# EAGLE design wifischematic (EAGLE 7.5.0)
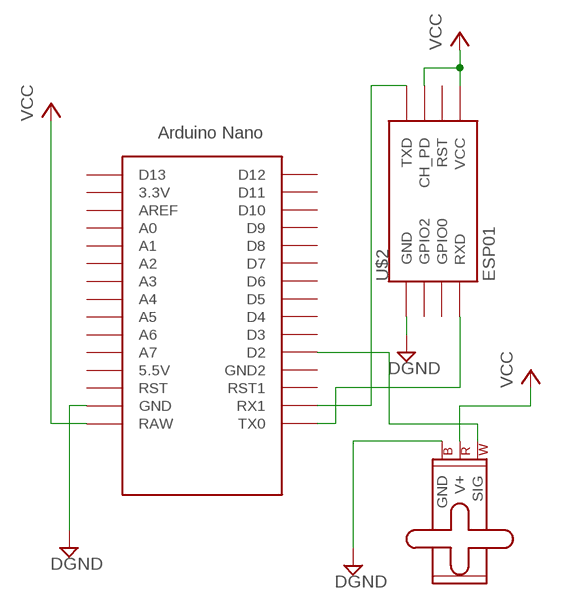
[diagram p0: schematic, sheet 1]

## Parts
M1  SMALL_SERVO  [1X03]
U$1  NANO  [NANO]
U$2  ESP01  [ESP01]

## Nets
DGND: M1.3(GND) U$1.GND U$2.GND
N$2: U$1.TX0 U$2.RX(RXD)
N$3: U$1.RX1 U$2.TX(TXD)
N$4: M1.1(SIG) U$1.D2
VCC: M1.2(V+) U$1.RAW U$2.CH_PD U$2.VCC
Unconnected: U$1.3.3V U$1.5V(5.5V) U$1.A0 U$1.A1 U$1.A2 U$1.A3 U$1.A4 U$1.A5 U$1.A6 U$1.A7 U$1.AREF U$1.D3 U$1.D4 U$1.D5 U$1.D6 U$1.D7 U$1.D8 U$1.D9 U$1.D10 U$1.D11 U$1.D12 U$1.D13 U$1.GND1(GND2) U$1.ICSP1 U$1.ICSP2 U$1.ICSP3 U$1.ICSP4 U$1.ICSP5 U$1.ICSP6 U$1.RST U$1.RST1 U$2.GPIO0 U$2.GPIO2 U$2.RST

## Library data of the parts
M1 = SparkFun-Electromechanical:SMALL_SERVO: Small servo motor This is the small servo used in the SIK. SKU: ROB-09065
U$1 = Arduino-clone:NANO: Arduino Nano
U$2 = esp8266modules:ESP01: ESP8266 Wifi module 01

## Board
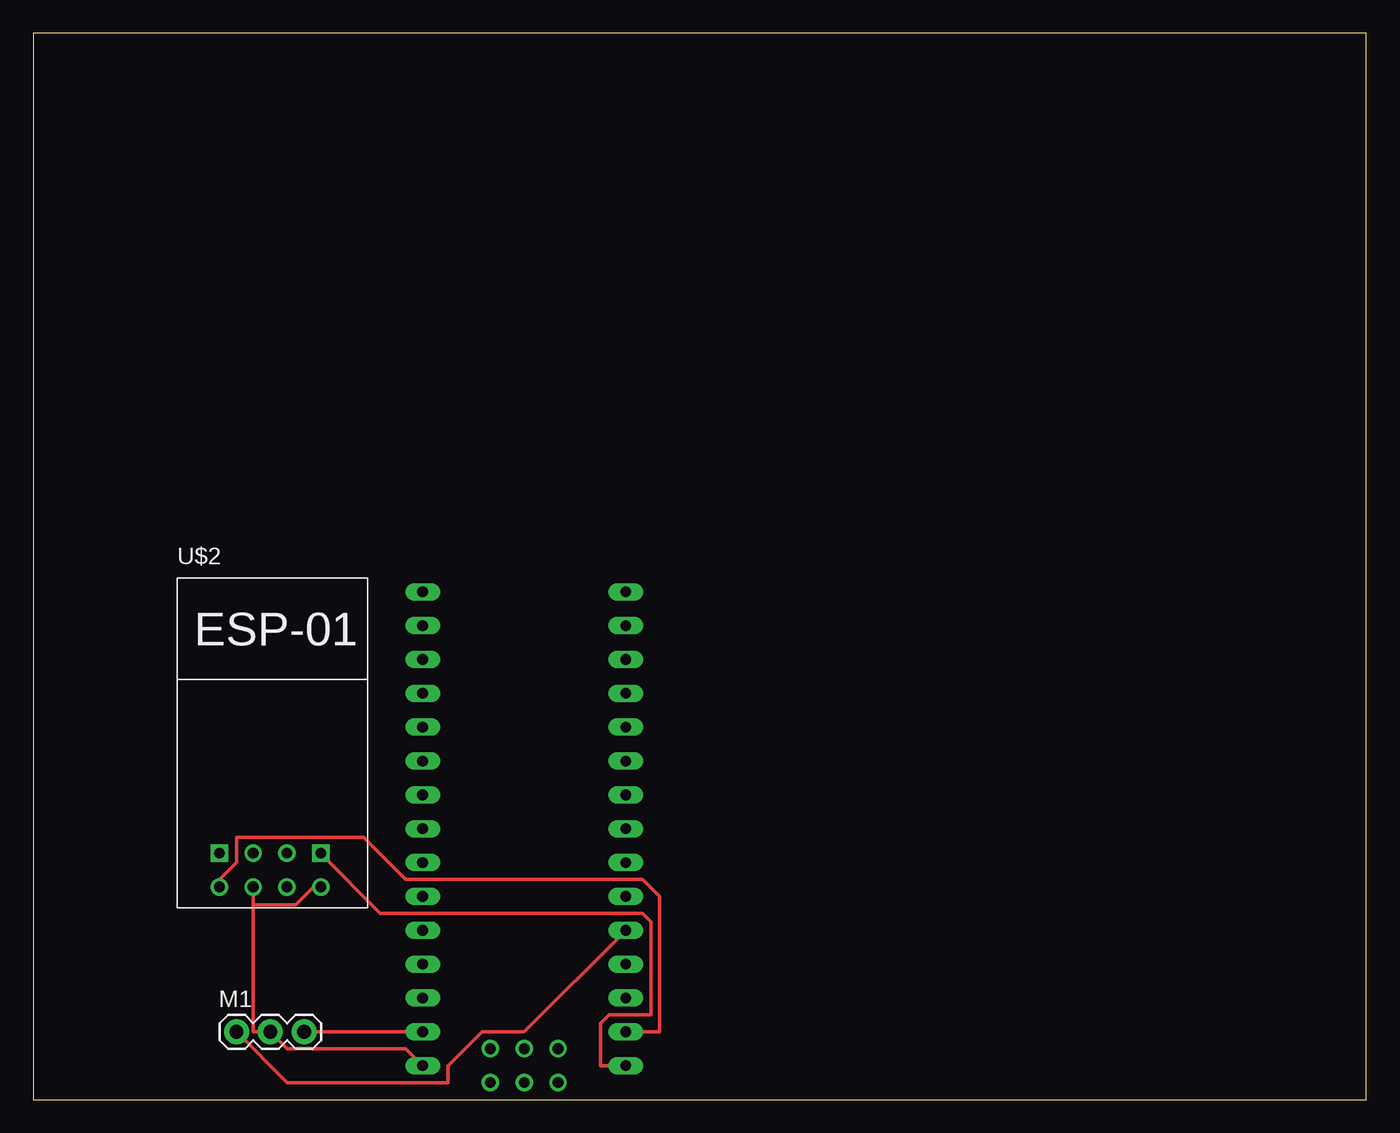
[diagram p1: board, top side]
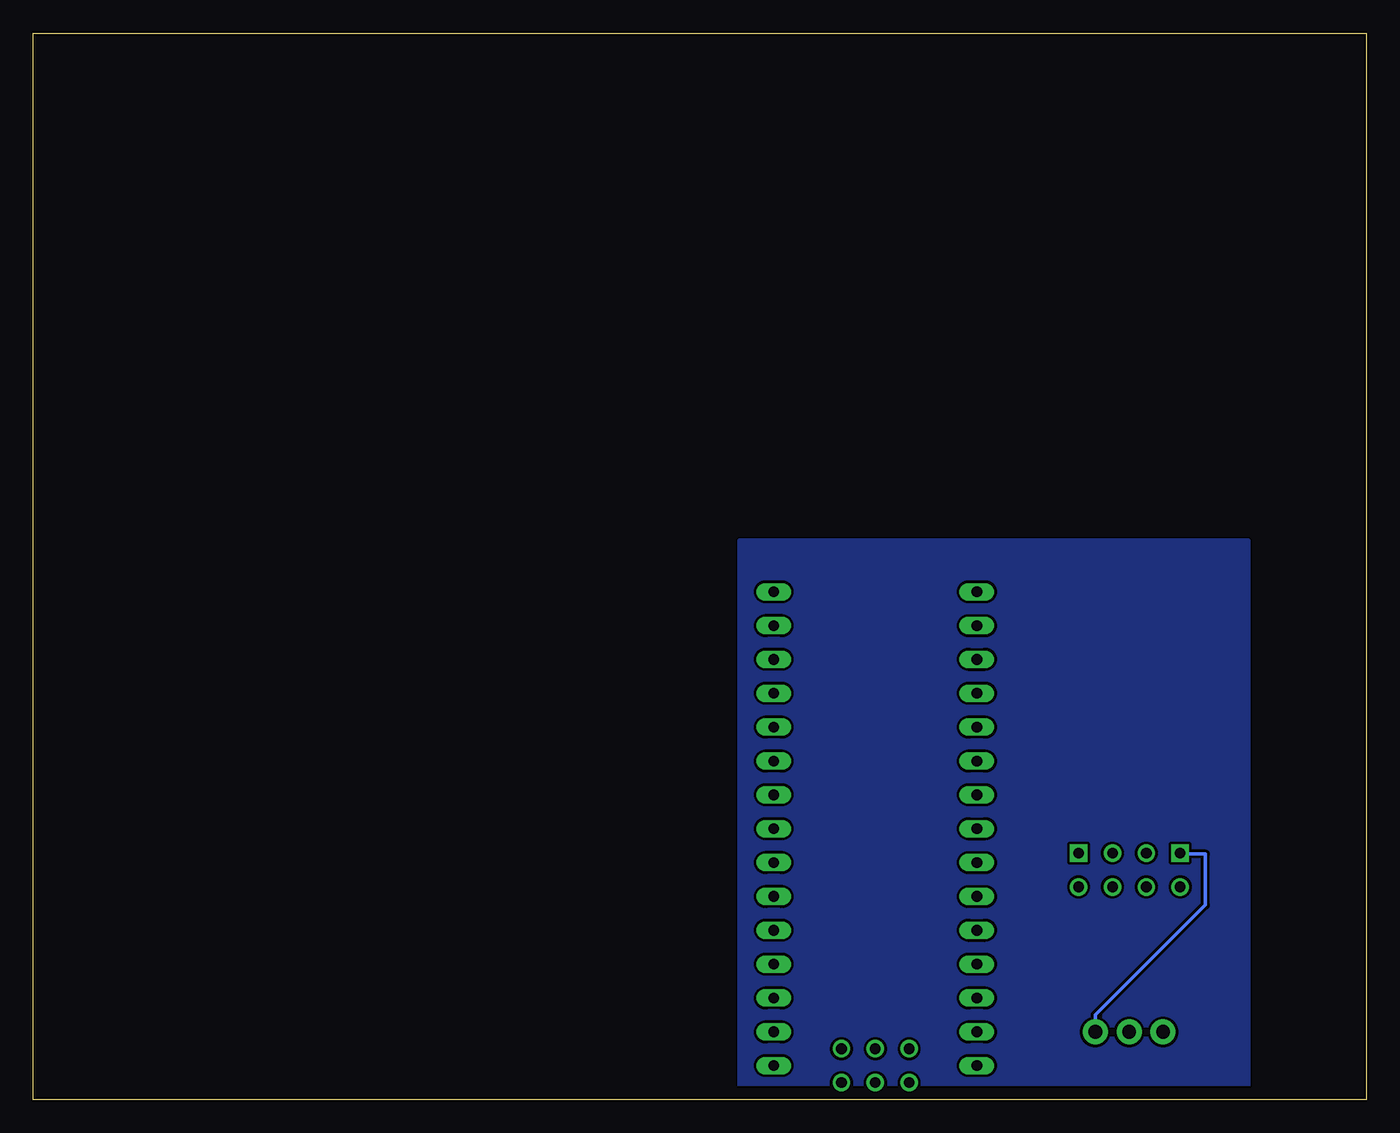
[diagram p2: board, bottom side, seen from below]

Size 100 x 80 mm. Coordinates in mm from the lower left corner, seen from the top.
Outline: 0,0 100,0 100,80 0,80 0,0
Copper layers (1*16): Top 0.035mm / dielectric 1.5mm / Bottom 0.035mm
Design rules "default": minimum track width 10mil, minimum drill 24mil, track to track 8mil, track to pad 8mil, pad to pad 8mil, via to via 8mil, smd to smd 8mil, copper to edge 40mil, drill to drill 8mil, minimum pad ring 10mil, minimum via ring 8mil, stop-mask expansion 4mil, vias tented up to drill 0mil, thermal gap 10mil

### Footprints (pad centres in the part's own frame; a part is rotated, then mirrored left to right if it is on the bottom)
1X03 = drill 1.016 pad 1.88: 1 0,0; 2 2.54,0; 3 5.08,0
NANO = drill 0.8 long: 3.3V -10.16,24.13; 5V -10.16,-1.27; A0 -10.16,19.05; A1 -10.16,16.51; A2 -10.16,13.97; A3 -10.16,11.43; A4 -10.16,8.89; A5 -10.16,6.35; A6 -10.16,3.81; A7 -10.16,1.27; AREF -10.16,21.59; D2 5.08,1.27; D3 5.08,3.81; D4 5.08,6.35; D5 5.08,8.89; D6 5.08,11.43; D7 5.08,13.97; D8 5.08,16.51; D9 5.08,19.05; D10 5.08,21.59; D11 5.08,24.13; D12 5.08,26.67; D13 -10.16,26.67; GND -10.16,-6.35; GND1 5.08,-1.27; RAW -10.16,-8.89; RST -10.16,-3.81; RST1 5.08,-3.81; RX1 5.08,-6.35; TX0 5.08,-8.89 | drill 0.8: ICSP1 -5.08,-10.16; ICSP2 -5.08,-7.62; ICSP3 -2.54,-10.16; ICSP4 -2.54,-7.62; ICSP5 0,-10.16; ICSP6 0,-7.62
ESP01 = drill 0.8: CH_PD -1.285,-8.178; GPIO0 1.255,-5.638; GPIO2 -1.285,-5.638; RST 1.255,-8.178; TX -3.825,-8.178; VCC 3.795,-8.178 | drill 0.8 square: GND -3.825,-5.638; RX 3.795,-5.638

### Placement (x,y rotation side)
M1  15.24,5.08 0 top
U$1  39.37,11.43 0 top
U$2  17.78,24.13 0 top

### Tracks (layer width: path | path; a pad name or v marks a point on that pad's centre or on a via)
DGND
  Top 0.254: M1.3 U$1.GND
  Bottom 0.254: M1.3 20.32,6.35 12.06,14.61 12.06,18.41 13.34,18.41 U$2.GND
GND
  pour Bottom: 8.89,41.91 46.99,41.91 46.99,0 8.89,0
N$2
  Top 0.254: U$1.TX0 42.55,2.54 42.55,5.71 43.18,6.35 46.35,6.35 46.35,13.34 45.72,13.97 26.04,13.97 21.59,18.41 U$2.RX
N$3
  Top 0.254: U$1.RX1 46.99,5.08 46.99,15.24 45.72,16.51 27.94,16.51 24.77,19.68 15.24,19.68 15.24,17.78 13.97,16.51 U$2.TX
N$4
  Top 0.254: U$1.D2 36.83,5.08 33.66,5.08 31.11,2.54 31.11,1.27 19.05,1.27 M1.1
VCC
  Top 0.254: U$1.RAW 27.94,3.81 19.05,3.81 M1.2 16.51,5.08 16.51,14.61 | 16.51,14.61 16.51,15.88 U$2.CH_PD | 16.51,14.61 19.68,14.61 20.95,15.88 U$2.VCC